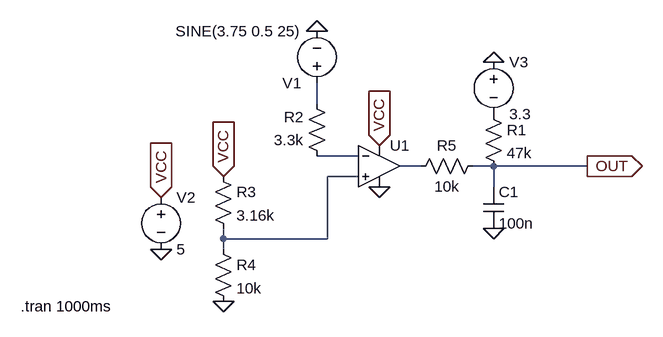
[diagram p0: schematic Comparator.asc]
Comparator.asc, the LTspice schematic file:
Version 4.1
SHEET 1 880 680
WIRE 0 32 0 0
WIRE 64 112 0 112
WIRE 160 128 128 128
WIRE 272 128 240 128
WIRE 416 128 272 128
WIRE 64 144 16 144
WIRE 272 160 272 128
WIRE -144 240 -144 224
WIRE 16 240 16 144
WIRE 16 240 -144 240
WIRE -144 256 -144 240
FLAG -240 256 0
FLAG -240 176 VCC
IOPIN -240 176 In
FLAG 96 96 VCC
IOPIN 96 96 In
FLAG 96 160 0
FLAG 272 224 0
FLAG 272 -32 0
FLAG 416 128 OUT
IOPIN 416 128 Out
FLAG 0 -80 0
FLAG -144 144 VCC
IOPIN -144 144 In
FLAG -144 336 0
SYMBOL voltage -240 160 R0
WINDOW 123 0 0 Left 0
WINDOW 39 0 0 Left 0
SYMATTR InstName V2
SYMATTR Value 5
SYMBOL res 256 32 R0
SYMATTR InstName R1
SYMATTR Value 47k
SYMBOL cap 256 160 R0
SYMATTR InstName C1
SYMATTR Value 100n
SYMBOL voltage 272 -48 R0
WINDOW 123 0 0 Left 0
WINDOW 39 0 0 Left 0
SYMATTR InstName V3
SYMATTR Value 3.3
SYMBOL voltage 0 16 R180
WINDOW 123 0 0 Left 0
WINDOW 39 0 0 Left 0
SYMATTR InstName V1
SYMATTR Value SINE(3.75 0.5 25)
SYMBOL res 16 128 R180
WINDOW 0 36 76 Left 2
WINDOW 3 36 40 Left 2
SYMATTR InstName R2
SYMATTR Value 3.3k
SYMBOL res -160 128 R0
SYMATTR InstName R3
SYMATTR Value 3.16k
SYMBOL res -160 240 R0
SYMATTR InstName R4
SYMATTR Value 10k
SYMBOL OpAmps\\UniversalOpAmp2 96 128 R0
SYMATTR InstName U1
SYMBOL res 256 112 R90
WINDOW 0 0 56 VBottom 2
WINDOW 3 32 56 VTop 2
SYMATTR InstName R5
SYMATTR Value 10k
TEXT -456 344 Left 2 !.tran 1000ms

The netlist it stands for:
* Comparator.asc
V2 VCC 0 5
R1 P001 OUT 47k
C1 OUT 0 100n
V3 0 P001 3.3
V1 N001 0 SINE(3.75 0.5 25)
R2 N002 N001 3.3k
R3 VCC N004 3.16k
R4 N004 0 10k
X§U1 N004 N002 VCC 0 N003 level2 Avol=1Meg GBW=10Meg Slew=10Meg Ilimit=25m Rail=0 Vos=0 En=0 Enk=0 In=0 Ink=0 Rin=500Meg  ; pins In+ In- V+ V- OUT
R5 OUT N003 10k
.tran 1000ms
.lib UniversalOpAmp2.lib
.backanno
.end